# EAGLE design AnalogI_3_3V_LevelShift (EAGLE 7.6.0)
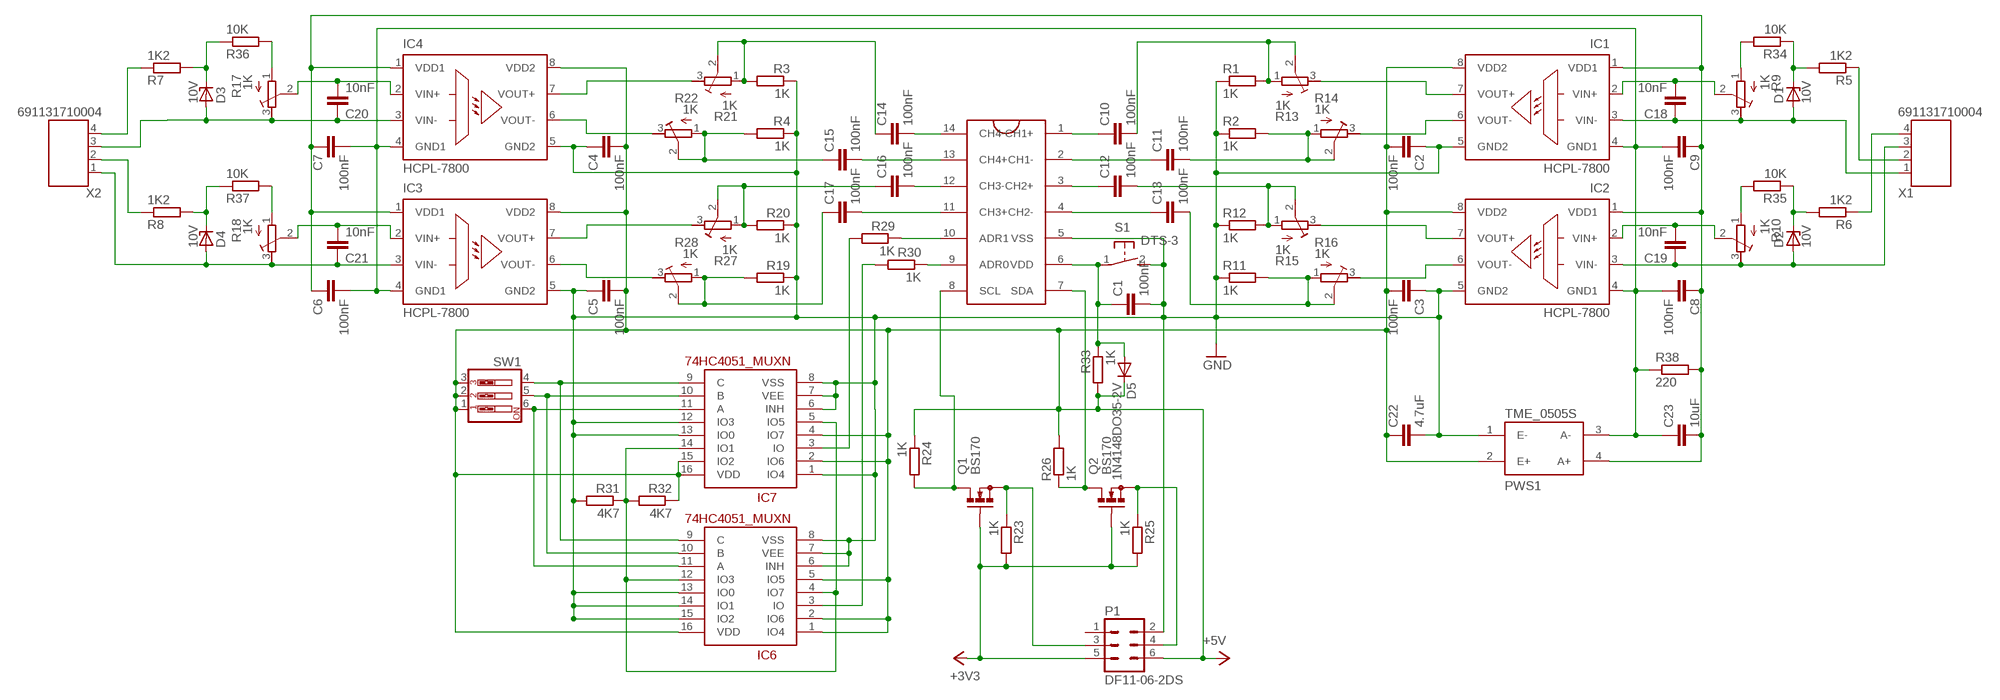
[diagram p0: schematic, sheet 1]

## Parts
C1  100nF  C-EU025-024X044  [C025-024X044]
C2  100nF  C-EU025-024X044  [C025-024X044]
C3  100nF  C-EU025-024X044  [C025-024X044]
C4  100nF  C-EU025-024X044  [C025-024X044]
C5  100nF  C-EU025-024X044  [C025-024X044]
C6  100nF  C-EU025-024X044  [C025-024X044]
C7  100nF  C-EU025-024X044  [C025-024X044]
C8  100nF  C-EU025-024X044  [C025-024X044]
C9  100nF  C-EU025-024X044  [C025-024X044]
C10  100nF  C5/3  [C5B3]
C11  100nF  C5/3  [C5B3]
C12  100nF  C5/3  [C5B3]
C13  100nF  C5/3  [C5B3]
C14  100nF  C5/3  [C5B3]
C15  100nF  C5/3  [C5B3]
C16  100nF  C5/3  [C5B3]
C17  100nF  C5/3  [C5B3]
C18  10nF  C2,5-3  [C2.5-3]
C19  10nF  C2,5-3  [C2.5-3]
C20  10nF  C2,5-3  [C2.5-3]
C21  10nF  C2,5-3  [C2.5-3]
C22  4.7uF  C-EUC0805  [C0805]
C23  10uF  C-EUC0805  [C0805]
D1  10V  ZENER-DIODEZD-2.5  [ZDIO-2.5]
D2  10V  ZENER-DIODEZD-2.5  [ZDIO-2.5]
D3  10V  ZENER-DIODEZD-2.5  [ZDIO-2.5]
D4  10V  ZENER-DIODEZD-2.5  [ZDIO-2.5]
D5  1N4148DO35-2V  [DO35-2V]
IC1  HCPL-7800  [DIL08]
IC2  HCPL-7800  [DIL08]
IC3  HCPL-7800  [DIL08]
IC4  HCPL-7800  [DIL08]
IC5  MCP3424SOIC  [14LDSOIC]
IC6  74HC4051_MUXN  [DIL16]
IC7  74HC4051_MUXN  [DIL16]
P1  DF11-06-2DS  [DF11-06DP-2DS]
PWS1  TME_0505S  [TMEXXXXS]
Q1  BS170  [SOT54E]
Q2  BS170  [SOT54E]
R1  1K  R-EU_0204/2V  [0204V]
R2  1K  R-EU_0204/2V  [0204V]
R3  1K  R-EU_0204/2V  [0204V]
R4  1K  R-EU_0204/2V  [0204V]
R5  1K2  R-EU_0204/2V  [0204V]
R6  1K2  R-EU_0204/2V  [0204V]
R7  1K2  R-EU_0204/2V  [0204V]
R8  1K2  R-EU_0204/2V  [0204V]
R9  1K  R-TRIMM3296W  [RTRIM3296W]
R10  1K  R-TRIMM3296W  [RTRIM3296W]
R11  1K  R-EU_0204/2V  [0204V]
R12  1K  R-EU_0204/2V  [0204V]
R13  1K  R-TRIMM3296W  [RTRIM3296W]
R14  1K  R-TRIMM3296W  [RTRIM3296W]
R15  1K  R-TRIMM3296W  [RTRIM3296W]
R16  1K  R-TRIMM3296W  [RTRIM3296W]
R17  1K  R-TRIMM3296W  [RTRIM3296W]
R18  1K  R-TRIMM3296W  [RTRIM3296W]
R19  1K  R-EU_0204/2V  [0204V]
R20  1K  R-EU_0204/2V  [0204V]
R21  1K  R-TRIMM3296W  [RTRIM3296W]
R22  1K  R-TRIMM3296W  [RTRIM3296W]
R23  1K  R-EU_0204/2V  [0204V]
R24  1K  R-EU_0204/5  [0204/5]
R25  1K  R-EU_0204/2V  [0204V]
R26  1K  R-EU_0204/2V  [0204V]
R27  1K  R-TRIMM3296W  [RTRIM3296W]
R28  1K  R-TRIMM3296W  [RTRIM3296W]
R29  1K  R-EU_0204/5  [0204/5]
R30  1K  R-EU_0204/5  [0204/5]
R31  4K7  R-EU_0204/2V  [0204V]
R32  4K7  R-EU_0204/2V  [0204V]
R33  1K  R-EU_0204/2V  [0204V]
R34  10K  R-EU_0204/2V  [0204V]
R35  10K  R-EU_0204/2V  [0204V]
R36  10K  R-EU_0204/2V  [0204V]
R37  10K  R-EU_0204/2V  [0204V]
R38  220  R-EU_0204/2V  [0204V]
S1  DTS-3  [DTS-3]
SW1  SW_DIP-3  [EDG-03]
X1  691131710004  [691131710004]
X2  691131710004  [691131710004]

## Nets
+3V3: P1.5 Q1.G Q2.G R23.2 R25.2
+5V: C2.2 C3.2 C4.2 C5.2 C22.1 D5.C IC1.8(VDD2) IC2.8(VDD2) IC3.8(VDD2) IC4.8(VDD2) IC6.1(IO4) IC6.2(IO6) IC6.5(IO5) IC6.16(VDD) IC7.2(IO6) IC7.4(IO7) IC7.15(IO2) IC7.16(VDD) P1.6 PWS1.2(E+) R24.1 R26.2 R32.1 R33.2 SW1.1 SW1.2 SW1.3
AGND: C6.2 C7.2 C8.2 C9.2 C23.1 IC1.4(GND1) IC2.4(GND1) IC3.4(GND1) IC4.4(GND1) PWS1.3(A-) R38.1
GND: C1.2 C2.1 C3.1 C4.1 C5.1 C22.2 IC1.5(GND2) IC2.5(GND2) IC3.5(GND2) IC4.5(GND2) IC5.5(VSS) IC6.6(INH) IC6.7(VEE) IC6.8(VSS) IC6.13(IO0) IC6.14(IO1) IC6.15(IO2) IC7.1(IO4) IC7.6(INH) IC7.7(VEE) IC7.8(VSS) IC7.12(IO3) IC7.13(IO0) P1.2 PWS1.1(E-) R1.1 R2.1 R3.1 R4.1 R11.1 R12.1 R19.1 R20.1 R31.2 S1.2
N$1: C14.2 IC5.14(CH4-)
N$2: C15.2 IC5.13(CH4+)
N$3: C16.2 IC5.12(CH3-)
N$4: C17.2 IC5.11(CH3+)
N$5: C19.1 D2.A IC2.3(VIN-) R10.3(E) X1.3
N$6: R5.1 X1.2
N$7: D1.C R5.2 R34.1
N$8: C6.1 C7.1 C8.1 C9.1 C23.2 IC1.1(VDD1) IC2.1(VDD1) IC3.1(VDD1) IC4.1(VDD1) PWS1.4(A+) R38.2
N$9: IC5.10(ADR1) R29.1
N$10: IC5.9(ADR0) R30.1
N$11: C18.2 IC1.2(VIN+) R9.2(S)
N$12: C19.2 IC2.2(VIN+) R10.2(S)
N$13: C10.1 IC5.1(CH1+)
N$14: C20.2 IC4.2(VIN+) R17.2(S)
N$15: C11.1 IC5.2(CH1-)
N$16: C21.1 D4.A IC3.3(VIN-) R18.3(E) X2.1
N$17: C12.1 IC5.3(CH2+)
N$18: C12.2 R12.2 R15.1(A) R15.2(S)
N$19: C21.2 IC3.2(VIN+) R18.2(S)
N$20: R6.1 X1.4
N$21: D2.C R6.2 R35.1
N$22: IC1.7(VOUT+) R13.3(E)
N$23: IC1.6(VOUT-) R14.3(E)
N$24: C10.2 R1.2 R13.1(A) R13.2(S)
N$25: IC2.6(VOUT-) R16.3(E)
N$26: IC2.7(VOUT+) R15.3(E)
N$27: C11.2 R2.2 R14.1(A) R14.2(S)
N$28: R7.1 X2.4
N$29: C13.2 R11.2 R16.1(A) R16.2(S)
N$30: C18.1 D1.A IC1.3(VIN-) R9.3(E) X1.1
N$31: C13.1 IC5.4(CH2-)
N$32: D3.C R7.2 R36.1
N$34: R8.1 X2.2
N$35: D4.C R8.2 R37.1
N$36: IC7.3(IO) R29.2
N$37: IC6.9(C) IC7.9(C) SW1.4
N$38: IC4.7(VOUT+) R21.3(E)
N$39: IC4.6(VOUT-) R22.3(E)
N$40: C15.1 R4.2 R22.1(A) R22.2(S)
N$41: C20.1 D3.A IC4.3(VIN-) R17.3(E) X2.3
N$42: C14.1 R3.2 R21.1(A) R21.2(S)
N$43: IC3.6(VOUT-) R28.3(E)
N$44: IC3.7(VOUT+) R27.3(E)
N$45: C17.1 R19.2 R28.1(A) R28.2(S)
N$46: C16.1 R20.2 R27.1(A) R27.2(S)
N$47: IC6.10(B) IC7.10(B) SW1.5
N$48: IC6.11(A) IC7.11(A) SW1.6
N$49: IC6.3(IO) R30.2
N$51: IC6.4(IO7) IC6.12(IO3) IC7.5(IO5) IC7.14(IO1) R31.1 R32.2
N$52: C1.1 D5.A IC5.6(VDD) R33.1 S1.1
N$53: R9.1(A) R34.2
N$54: R10.1(A) R35.2
N$55: R17.1(A) R36.2
N$56: R18.1(A) R37.2
N$58: IC5.8(SCL) Q1.D R24.2
N$61: IC5.7(SDA) Q2.D R26.1
N$69: P1.4 Q2.S R25.1
N$71: P1.3 Q1.S R23.1
Unconnected: P1.1

## Library data of the parts
C1-C9 C22 C23 = rcl:C-EU: CAPACITOR, European symbol
C10-C21 = capacitor-wima:C: CAPACITOR naming: grid - package width
D1-D4 = diode:ZENER-DIODE: Z-Diode
D5 = diode:1N4148: DIODE high speed (Philips)
IC1-IC4 = avago:HCPL-7800: Isolation Amplifer Source: http://www.avagotech.com/docs/AV02-0410EN; MPN: HCPL-7800A#500; OC_FARNELL: 459446; OC_NEWARK: 05M6395
IC5 = mcp3424:MCP3424
IC6 IC7 = SparkFun-AnalogIC:74HC4051_MUX: 8:1 analog mux
P1 = con-hirose-df11:DF11-06-2: HEADER; OC_FARNELL: unknown
PWS1 = traco-electronic:TME_*S: DC/DC Konverter 1 Watt Source: http://www.tracopower.com/datasheet_g/tme-d.pdf; MPN: TME 0505S; OC_FARNELL: 1007538; OC_NEWARK: 51R5321
Q1 Q2 = transistor-small-signal:BS170: N-CHANNEL MOS FET; MF: ON SEMICONDUCTOR; MPN: BS170G; OC_FARNELL: 9556192
R1-R8 R11 R12 R19 R20 R29-R38 = rcl:R-EU_: RESISTOR, European symbol
R9 R10 R13-R18 R21 R22 R27 R28 = resistor:R-TRIMM: Trimm resistor
R23-R26 = rcl:R-EU_: RESISTOR, European symbol; OC_FARNELL: unknown
S1 = switch-tact:DTS-3
SW1 = special:SW_DIP-3: DIP SWITCH
X1 X2 = con-wuerth:691131710004: WR-TBL Terminal block - CUU5/4 - 4 Pins;=>Code : Con_TBL_Screw_PClamp_5.00_6911317100xx_691131710004 <http://katalog.we-online.de/media/images/eican/Con_TBL_Screw_PClamp_5.00_6911317100xx_pf2.jpg> Details see: http://katalog.we-online.de/em/datasheet/6911317100xx.pdf Created 11/3/2014, Karrer Zheng 2014 (C) Wurth Elektronik

## Board
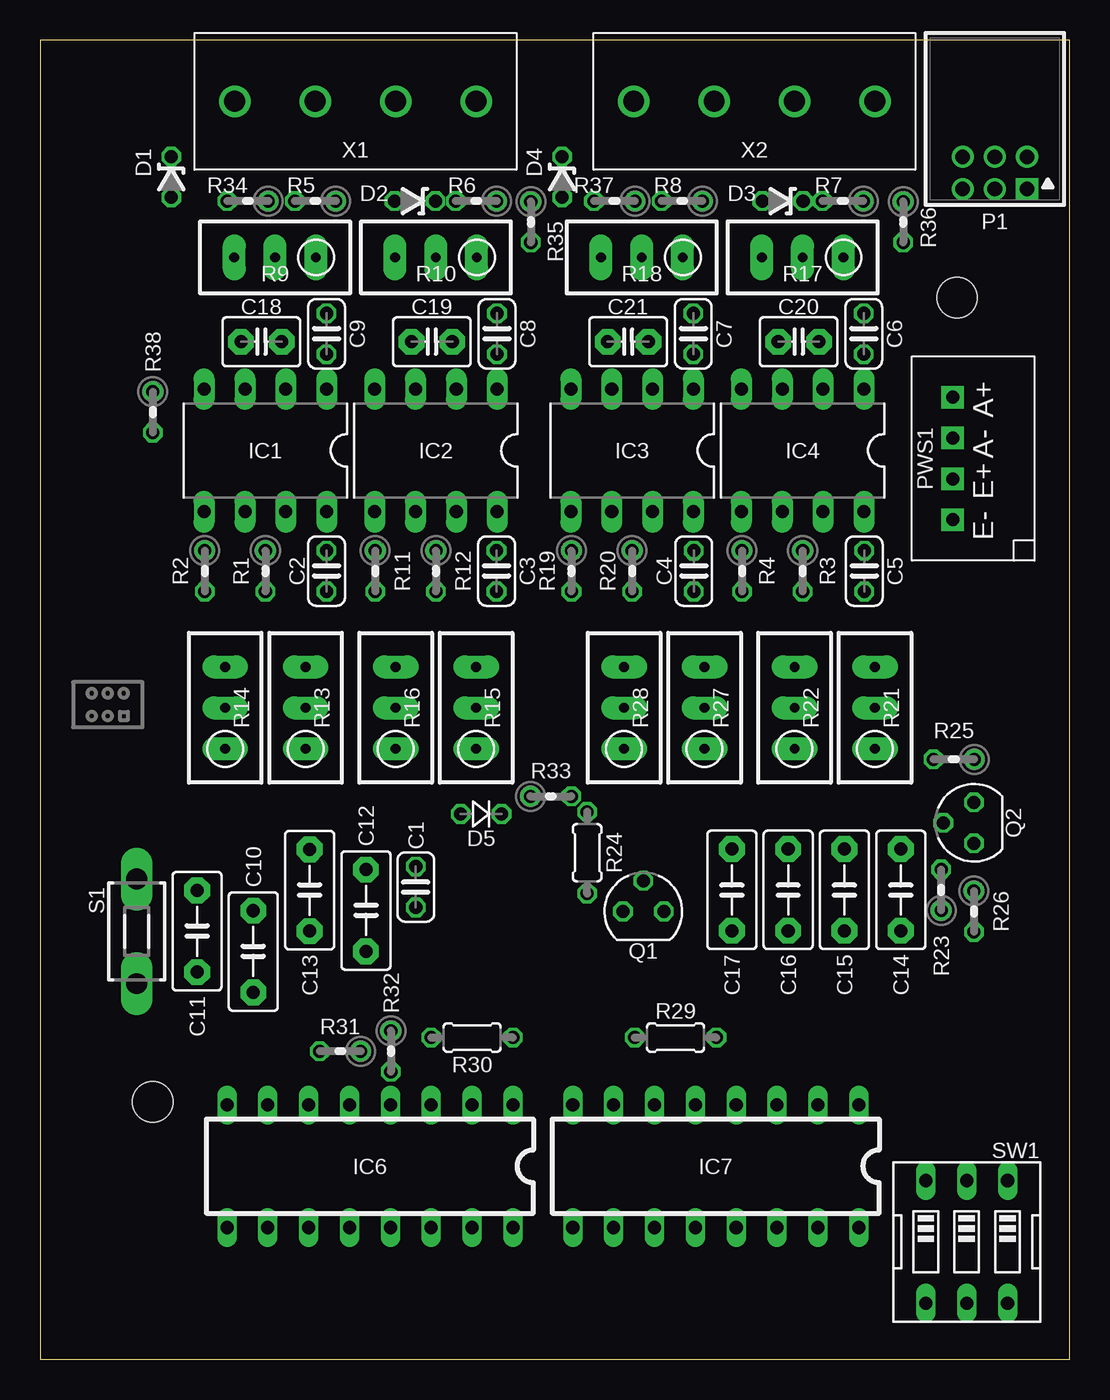
[diagram p1: board, top side]
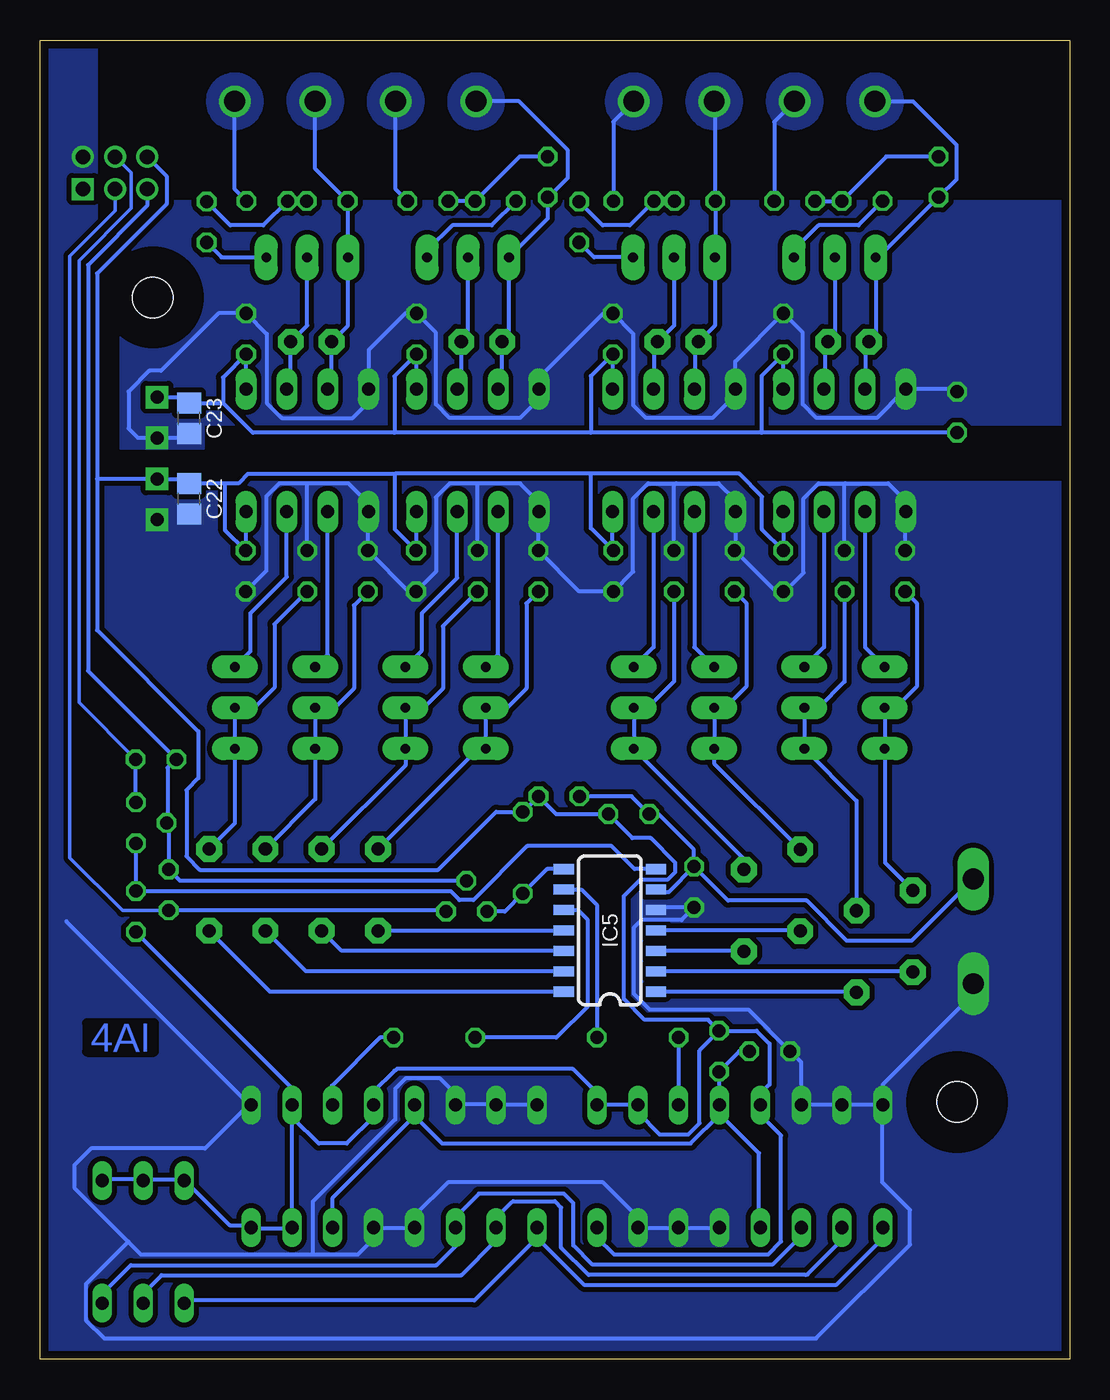
[diagram p2: board, bottom side, seen from below]

Size 64 x 82 mm. Coordinates in mm from the lower left corner, seen from the top.
Outline: 0,0 64,0 64,82 0,82 0,0
Copper layers (1*16): Top 0.035mm / dielectric 1.6mm / Bottom 0.035mm
Design rules "Elecrow": minimum track width 6mil, minimum drill 12mil, track to track 6mil, track to pad 6mil, pad to pad 6mil, via to via 8mil, smd to smd 0mil, copper to edge 20mil, drill to drill 10mil, minimum pad ring 6mil, minimum via ring 6mil, stop-mask expansion 0mil, vias tented up to drill 100mil, thermal gap 10mil
Holes 2.5 mm at 7,16 57,66
bRestrict: area 54.1,63.1 to 59.9,68.8; area 4.2,13.2 to 9.8,18.9

### Footprints (pad centres in the part's own frame; a part is rotated, then mirrored left to right if it is on the bottom)
C025-024X044 = drill 0.813 octagon: 1 -1.27,0; 2 1.27,0
C5B3 = drill 0.813 pad 1.6 octagon: 1 -2.54,0; 2 2.54,0
C2.5-3 = drill 0.813 pad 1.6 octagon: 1 -1.27,0; 2 1.27,0
C0805 = smd 1.3 x 1.5: 1 -0.95,0; 2 0.95,0
ZDIO-2.5 = drill 0.813 octagon: A 1.27,0; C -1.27,0
DO35-2V = drill 0.813 octagon: A 1.27,0; C -1.27,0
DIL08 = drill 0.813 pad 1.3 long: 1 -3.81,-3.81; 2 -1.27,-3.81; 3 1.27,-3.81; 4 3.81,-3.81; 5 3.81,3.81; 6 1.27,3.81; 7 -1.27,3.81; 8 -3.81,3.81
14LDSOIC = smd 1.27 x 0.635: 1 -2.87,3.81; 2 -2.87,2.54; 3 -2.87,1.27; 4 -2.87,0; 5 -2.87,-1.27; 6 -2.87,-2.54; 7 -2.87,-3.81; 8 2.87,-3.81; 9 2.87,-2.54; 10 2.87,-1.27; 11 2.87,0; 12 2.87,1.27; 13 2.87,2.54; 14 2.87,3.81
DIL16 = drill 0.813 long: 1 -8.89,-3.81; 2 -6.35,-3.81; 3 -3.81,-3.81; 4 -1.27,-3.81; 5 1.27,-3.81; 6 3.81,-3.81; 7 6.35,-3.81; 8 8.89,-3.81; 9 8.89,3.81; 10 6.35,3.81; 11 3.81,3.81; 12 1.27,3.81; 13 -1.27,3.81; 14 -3.81,3.81; 15 -6.35,3.81; 16 -8.89,3.81
DF11-06DP-2DS = drill 0.914 square: 1 2,-1 | drill 0.914: 2 2,1; 3 0,-1; 4 0,1; 5 -2,-1; 6 -2,1
TMEXXXXS = drill 0.813 pad 1.397 square: 1 -3.81,1.27; 2 -1.27,1.27; 3 1.27,1.27; 4 3.81,1.27
SOT54E = drill 0.813 octagon: D -1.27,0; G 0,1.905; S 1.27,0
0204V = drill 0.813 octagon: 1 -1.27,0; 2 1.27,0
RTRIM3296W = drill 0.61 pad 1.422 long: 1 0,-2.54; 2 0,0; 3 0,2.54
0204/5 = drill 0.813 octagon: 1 -2.54,0; 2 2.54,0
DTS-3 = drill 1.3 long: 1 -3.25,0; 2 3.25,0
EDG-03 = drill 0.813 long: 1 -2.54,-3.81; 2 0,-3.81; 3 2.54,-3.81; 4 2.54,3.81; 5 0,3.81; 6 -2.54,3.81
691131710004 = drill 1.3: 1 -7.5,0; 2 -2.5,0; 3 2.5,0; 4 7.5,0

### Placement (x,y rotation side)
C1  23.35,29.36 270 top
C2  17.8,49 90 top
C3  28.37,49 90 top
C4  40.63,49 90 top
C5  51.23,49 90 top
C6  51.2,63.75 90 top
C7  40.6,63.75 90 top
C8  28.4,63.75 90 top
C9  17.8,63.75 90 top
C10  13.25,25.35 90 top
C11  9.75,26.61 90 top
C12  20.25,27.9 90 top
C13  16.75,29.16 90 top
C14  53.5,29.18 270 top
C15  50,29.18 270 top
C16  46.5,29.18 270 top
C17  43,29.18 270 top
C18  13.75,63.25 0 top
C19  24.35,63.25 0 top
C20  47.15,63.25 0 top
C21  36.55,63.25 0 top
C22  54.75,53.5 270 bottom
C23  54.75,58.5 90 bottom
D1  8.15,73.5 270 top
D2  23.3,72 180 top
D3  46.16,72 180 top
D4  32.45,73.5 270 top
D5  27.41,33.9 180 top
IC1  14,56.5 180 top
IC2  24.6,56.5 180 top
IC3  36.8,56.5 180 top
IC4  47.4,56.5 180 top
IC5  28.59,26.66 180 bottom
IC6  20.5,12 180 top
IC7  42,12 180 top
P1  59.35,73.75 0 top
PWS1  58,56 90 top
Q1  37.5,27.84 0 top
Q2  58.05,33.35 90 top
R1  14,49 270 top
R2  10.23,49 270 top
R3  47.4,49 270 top
R4  43.63,49 270 top
R5  17.1,72 180 top
R6  27.1,72 180 top
R7  49.9,72 180 top
R8  39.9,72 180 top
R9  14.6,68.5 90 top
R10  24.6,68.5 90 top
R11  20.83,49 270 top
R12  24.6,49 270 top
R13  16.5,40.5 0 top
R14  11.5,40.5 0 top
R15  27.1,40.5 0 top
R16  22.1,40.5 0 top
R17  47.4,68.5 90 top
R18  37.4,68.5 90 top
R19  33.03,49 270 top
R20  36.8,49 270 top
R21  51.9,40.5 0 top
R22  46.9,40.5 0 top
R23  56.01,29.18 90 top
R24  34,31.49 270 top
R25  56.8,37.3 180 top
R26  58.05,27.84 270 top
R27  41.3,40.5 0 top
R28  36.3,40.5 0 top
R29  39.5,20 0 top
R30  26.85,20 180 top
R31  18.65,19.15 180 top
R32  21.8,19.15 270 top
R33  31.75,35 0 top
R34  12.9,72 180 top
R35  30.5,70.7 270 top
R36  53.65,70.7 270 top
R37  35.7,72 180 top
R38  7,58.88 270 top
S1  6,26.6 270 top
SW1  57.6,7.3 180 top
X1  19.6,78.2 0 top
X2  44.4,78.2 0 top

### Tracks (layer width: path | path; a pad name or v marks a point on that pad's centre or on a via)
+3V3
  Bottom 0.203: Q2.G 56.01,33.36
  Bottom 0.254: 56.03,30.45 R23.2 | Q1.G 55.3,29.75 R23.2 | R23.2 56.01,33.36 56.01,33.45 56.08,33.53 56.08,36.78 55.68,37.19 R25.2 61.03,42.8 61.03,68.02 57.35,71.7 P1.5
+5V
  Bottom 0.254: IC6.1 29.26,15.85 27.03,15.85 IC6.2 26.85,15.34 25.49,13.98 23.74,13.98 23.72,13.96 23.01,14.67 23.01,19.19 21.8,20.4 R32.1 | SW1.1 59.94,11.18 57.71,11.18 SW1.2 57.51,11.18 55.07,11.18 SW1.3 54.86,10.97 52.22,8.33 51,8.33 IC7.16 50.8,8.13 48.36,8.13 IC7.15 48.35,14.77 48.2,14.92 | R32.1 19.47,20.42 18.66,19.61 18.66,17.09 19.22,16.53 IC6.5 | 29.26,8.13 IC6.16 29.37,8.17 29.37,7.56 28.31,6.5 18.77,6.5 17.95,7.32 17.95,13.91 19.22,15.18 IC6.5 | 19.1,15.65 IC6.5 | IC7.4 43.28,15.65 43.28,15.07 44.94,13.41 46.69,13.41 48.2,14.92 | 48.16,15.65 IC7.2 | 29.46,15.85 IC6.1 | 43.28,15.85 IC7.4 | IC7.2 48.36,15.85 48.36,16.88 R26.2 | IC7.4 43.29,15.83 43.29,16.62 41.97,17.94 41.95,17.94 41.84,18.05 30.89,18.05 29.4,16.56 IC6.1 | 48.2,14.92 48.32,15.04 48.32,15.78 IC7.2 | R32.1 22.48,21.1 26.42,21.1 27.72,22.4 27.72,28.79 26.67,29.84 24.96,29.84 24.51,30.29 24.51,30.87 26.04,32.4 27.18,32.4 D5.C 31.92,33.9 R33.2 R24.1 35.66,34.03 39.26,30.43 54.08,30.43 54.91,31.26 54.91,35.39 54.17,36.13 54.17,39.03 60.47,45.33 60.47,54.74 | P1.6 56.15,73.55 56.15,71.82 60.47,67.5 60.47,54.74 | 29.76,55.05 41.95,55.05 | IC1.8 C2.2 19.12,51.59 19.12,53.63 20.54,55.05 29.76,55.05 | 29.76,55.05 29.76,51.66 C3.2 28.41,50.31 IC2.8 | 41.95,55.05 41.95,51.59 C4.2 40.63,52.67 IC3.8 | 41.95,55.05 51.07,55.05 51.67,54.45 52.49,54.45 | 52.49,54.45 C22.1 55.03,54.73 PWS1.2 60.46,54.73 60.47,54.74 | 52.49,54.45 52.49,51.53 C5.2 51.21,50.29 IC4.8
AGND
  Bottom 0.254: C8.2 | C8.2 28.99,65.02 33.01,61 33.01,60.33 | 33.01,60.33 IC3.4 | C23.1 55.03,57.27 PWS1.3 56.75,57.29 57.93,57.29 58.51,57.87 58.51,60.16 57.21,61.46 56.48,61.46 52.92,65.02 C6.2 49.92,63.74 49.92,59.45 48.99,58.52 44.57,58.52 43.59,59.5 IC4.4 43.57,60.33 43.57,62.74 41.29,65.02 C7.2 39.4,63.82 39.4,59.37 38.55,58.52 34.16,58.52 33.01,59.67 33.01,60.33 | C8.2 27.12,63.74 27.12,59.29 26.35,58.52 22.21,58.52 20.79,59.94 IC2.4 20.79,62.03 C9.2 16.59,63.81 16.59,59.37 15.74,58.52 11.99,58.52 10.36,60.15 IC1.4 7.16,60.31 R38.1
  pour Bottom (isolate 0.305, no thermals): 0,58.1 59,58.1 59,72 0,72
  pour Bottom (isolate 0.305, no thermals): 59,58.5 59,56.62 53.85,56.62 53.85,58.5
GND
  Bottom 0.203: 47.05,6.62 47.06,6.62 47.06,6.5
  Bottom 0.254: 10.23,52.69 R2.1 | IC2.5 20.79,50.31 R11.1 20.73,50.19 18.29,47.75 17.88,47.75 C2.1 17.68,47.75 16.55,48.88 16.55,53.52 15.62,54.45 13.96,54.45 | 20.93,52.83 IC2.5 | IC6.8 11.79,15.85 14.02,15.85 IC6.7 | IC7.8 33.12,15.85 35.56,15.85 IC7.7 35.76,15.85 38,15.85 IC7.6 | 24.47,54.45 26.21,54.45 27.14,53.52 27.14,48.96 C3.1 30.49,47.73 R19.1 33.03,52.65 IC3.5 32.99,53.27 34.17,54.45 36.76,54.45 | 24.47,54.45 21.83,54.45 20.82,53.44 20.82,52.72 IC2.5 | R12.1 24.6,54.32 24.47,54.45 | 13.96,54.45 11.28,54.45 10.24,53.41 10.24,52.74 | R1.1 14,54.41 13.96,54.45 | 14.13,15.83 IC6.7 | 43.29,8.83 43.29,8.74 | 43.29,8.74 43.29,8.21 | 43.27,8.7 43.26,8.71 43.28,8.74 | 21.74,8.33 IC6.13 21.98,8.19 24.21,8.19 IC6.14 24.38,8.13 26.82,8.13 IC6.15 | IC7.12 40.78,8.19 43.02,8.19 IC7.13 | 25.36,27.93 IC5.5 25.45,27.93 25.29,28.09 C1.2 | IC6.7 IC6.6 | 43.28,8.74 43.29,8.74 | 43.28,8.74 IC7.13 | IC6.6 16.69,18.46 R31.2 19.98,21.75 26.12,21.75 27.11,22.74 27.11,26.81 26.61,27.31 24.13,27.31 C1.2 | 23.16,28.25 C1.2 | 62.38,27.23 51,15.85 IC7.1 51.05,15.81 53.75,13.11 60.84,13.11 61.88,12.07 61.88,10.67 58.52,7.32 | 27.03,8.33 IC6.15 | 40.64,8.33 IC7.12 | 38.2,15.85 IC7.6 | 43.28,8.13 IC7.13 | 16.87,15.65 IC6.6 | 58.52,7.32 57.71,6.5 47.06,6.5 44.27,6.5 43.28,7.49 IC7.13 | IC7.6 38.17,15.83 38.17,16.5 39.13,17.46 41.29,17.46 41.93,16.82 41.93,14.91 47.05,9.79 47.05,6.62 47.05,6.6 | 58.52,7.32 61.16,4.67 61.16,2.44 60.02,1.29 15.76,1.29 9.93,7.12 9.93,9.28 11.66,11.01 11.66,15.54 IC6.8 | 11.58,15.65 IC6.8 | IC7.12 40.72,8.94 38.66,11 29.01,11 26.85,8.84 IC6.15 | 36.76,54.45 38.54,54.45 39.4,53.59 39.4,48.96 C4.1 41.09,47.73 R4.1 43.63,52.65 IC4.5 43.59,53.21 44.83,54.45 47.38,54.45
  Bottom 0.254: R20.1 36.8,54.41 36.76,54.45 | 47.38,54.45 49.14,54.45 49.95,53.64 49.95,49.01 C5.1 | R3.1 47.4,54.43 47.38,54.45 | S1.2 6,22.7 11.62,17.08 IC6.8
  pour Bottom (isolate 0.305, no thermals): 0,54.54 64,54.54 64,0 0,0
  pour Bottom (isolate 0.305, no thermals): 60.5,54.54 29.5,54.54 29.5,0 64,0 64,82 60.5,82
N$1
  Bottom 0.254: IC5.14 49.71,22.85 C14.2
N$2
  Bottom 0.254: IC5.13 47.48,24.12 C15.2
N$3
  Bottom 0.254: IC5.12 45.25,25.39 C16.2
N$4
  Bottom 0.254: IC5.11 31.41,26.64 C17.2
N$5
  Bottom 0.254: X1.3 22.03,78.13 D2.A 22.03,68.53 R10.3 22.06,64.27 C19.1 23.28,63.05 23.28,61.05 23.33,61 IC2.3
  pour Bottom (no thermals): 21,77 arc180 23.2,79.4 arc180
N$6
  Bottom 0.254: X1.2 18.37,76.93 R5.1
  pour Bottom (no thermals): 16,77 arc180 18.2,79.4 arc180
N$7
  Bottom 0.254: R5.2 R34.1 11.4,74.77 D1.C
N$8
  Bottom 0.254: IC4.1 C6.1 52.64,61.04 52.64,59.45 | IC3.1 C7.1 41.97,61.11 41.97,57.6 | IC2.1 C8.1 29.76,61.12 29.76,57.6 | IC1.1 C9.1 19.15,61.13 19.15,57.6 | 19.15,57.6 29.76,57.6 | 29.76,57.6 41.97,57.6 | 41.97,57.6 50.79,57.6 52.64,59.45 | PWS1.4 55.11,59.81 C23.2 52.64,59.45 | R38.2 19.15,57.6
N$9
  Bottom 0.254: IC5.10 30.57,27.93 29.99,27.35 29.99,21.92 31.91,20 R29.1
N$10
  Bottom 0.254: IC5.9 30.35,29.2 29.4,28.25 R30.1
N$11
  Bottom 0.254: IC1.2 15.27,60.79 15.22,60.84 15.22,63.05 C18.2 14.6,63.67 R9.2
N$12
  Bottom 0.254: IC2.2 25.87,61.03 25.83,61.07 25.83,63.04 C19.2 24.6,64.27 R10.2
N$13
  Bottom 0.254: 25.74,22.8 IC5.1 13.29,22.85 C10.1
N$14
  Bottom 0.254: IC4.2 48.42,60.56 C20.2 47.4,64.27 R17.2
N$15
  Bottom 0.254: 25.75,24.08 IC5.2 9.8,24.12 C11.1
N$16
  Bottom 0.254: IC3.3 35.28,60.56 C21.1 34.86,63.67 R18.3 32.45,70.91 D4.A 32.4,72.23 31.19,73.44 31.19,75.16 34.23,78.2 X2.1
  pour Bottom (no thermals): 35.8,77 arc180 38,79.4 arc180
N$17
  Bottom 0.254: 25.77,25.37 IC5.3 20.28,25.39 C12.1
N$18
  Bottom 0.254: 27.1,37.94 27.1,40.38 R15.2 26.24,40.5 24.6,42.14 R12.2 | 27.1,37.94 R15.1 | 27.1,37.94 20.25,31.09 C12.2
N$19
  Bottom 0.254: R18.2 37.4,63.67 C21.2 37.82,60.56 IC3.2
N$20
  Bottom 0.254: X1.4 28.37,76.93 R6.1
  pour Bottom (no thermals): 26,77 arc180 28.2,79.4 arc180
N$21
  Bottom 0.254: D2.C R6.2 27.34,70.5 29.03,70.5 R35.1
N$22
  Bottom 0.254: IC1.7 15.27,44.27 R13.3
N$23
  Bottom 0.254: IC1.6 12.73,44.27 R14.3
N$24
  Bottom 0.254: R1.2 14,42.13 15.63,40.5 R13.2 16.49,40.46 16.49,38.02 R13.1 13.25,34.71 C10.2
N$25
  Bottom 0.254: IC2.6 23.33,44.27 R16.3
N$26
  Bottom 0.254: IC2.7 25.87,44.27 R15.3
N$27
  Bottom 0.254: R2.2 9.51,47.01 9.51,41.82 10.83,40.5 R14.2 R14.1 11.48,37.94 11.48,30.88 C11.2
N$28
  Bottom 0.254: R7.1 51.9,72.73 X2.4
  pour Bottom (no thermals): 50.8,77 arc180 53,79.4 arc180
N$29
  Bottom 0.254: R16.1 22.09,38 22.09,40.44 R16.2 21.42,40.5 20.1,41.82 20.1,47 R11.2 | 22.12,37.94 R16.1 | R16.1 22.1,37.05 C13.2
N$30
  Bottom 0.254: X1.1 9.74,78.2 7.04,75.5 7.04,73.34 D1.A 11.88,68.5 R9.3 12.06,63.67 C18.1 12.69,63.04 12.69,60.96 12.73,60.92 IC1.3
  pour Bottom (no thermals): 11,77 arc180 13.2,79.4 arc180
N$31
  Bottom 0.254: 25.77,26.64 IC5.4 16.79,26.66 C13.1
N$32
  Bottom 0.254: D3.C R7.2 50.13,70.5 52.19,70.5 R36.1
N$34
  Bottom 0.254: R8.1 41.9,72.73 X2.2
  pour Bottom (no thermals): 40.8,77 arc180 43,79.4 arc180
N$35
  Bottom 0.254: R8.2 R37.1 34.2,74.77 D4.C
N$36
  Bottom 0.254: R29.2 42.87,20 45.86,17.01 45.86,15.86 IC7.3
N$37
  Bottom 0.254: SW1.4 54.86,3.66 37.01,3.66 33.11,7.56 | 33.12,8.13 IC7.9 33.11,7.56 | IC6.9 11.61,7.53 14.54,4.6 30.15,4.6 33.11,7.56
N$38
  Bottom 0.254: R21.3 50.92,44.02 50.92,46.38 48.67,48.63 IC4.7
N$39
  Bottom 0.254: R22.3 46.13,43.81 IC4.6
N$40
  Bottom 0.254: C15.1 46.9,34.82 R22.1 R22.2 45.7,40.5 44.5,41.7 44.5,46.86 R4.2
N$41
  Bottom 0.254: X2.3 46.9,74.01 D3.A 44.89,68.53 R17.3 44.86,64.27 C20.1 45.88,60.56 IC4.3
  pour Bottom (no thermals): 45.8,77 arc180 48,79.4 arc180
N$42
  Bottom 0.254: C14.1 51.9,33.32 R21.1 R21.2 50.69,40.5 49.43,41.76 49.43,45.7 R3.2
N$43
  Bottom 0.254: R28.3 35.53,43.81 IC3.6
N$44
  Bottom 0.254: R27.3 40.27,44.07 40.27,46.38 38.07,48.58 IC3.7
N$45
  Bottom 0.254: R28.1 R28.2 34.97,40.5 33.77,41.7 33.77,46.99 R19.2 | 36.37,38.2 R28.1 | R28.1 36.37,37.8 36.92,37.8 C17.1
N$46
  Bottom 0.254: C16.1 41.3,36.92 R27.1 R27.2 40.16,40.5 38.96,41.7 38.96,45.57 R20.2
N$47
  Bottom 0.203: 57.6,4.08 SW1.5
  Bottom 0.254: 35.56,8.33 IC7.10 | 35.76,8.13 IC7.10 | IC6.10 14.19,8.15 14.19,7.39 16.3,5.28 16.42,5.24 29.91,5.24 31.61,6.94 31.61,9.43 32,9.82 34.6,9.82 34.71,9.75 35.66,8.8 IC7.10 | IC7.10 35.66,7.39 37.82,5.23 56.45,5.23 57.6,4.08
N$48
  Bottom 0.254: 38,8.33 IC7.11 | 16.66,8.33 IC6.11 16.87,8.13 16.87,7.32 17.05,7.32 18.48,5.88 29.65,5.88 30.85,7.08 30.85,9.71 31.44,10.3 36.73,10.3 38.19,8.84 IC7.11 | 60.16,3.47 SW1.6 60.15,4.07 58.37,5.85 39.36,5.85 38.19,7.02 IC7.11
N$49
  Bottom 0.254: R30.2 IC6.3
N$51
  Bottom 0.254: R31.1 20.53,19.15 R32.2 21.8,15.84 IC6.4 | 21.54,15.44 21.74,15.65 IC6.4 | IC6.12 19.3,8.33 19.3,12.8 21.74,15.24 | 21.74,15.24 23.57,13.41 39.01,13.41 40.73,15.13 | 21.74,15.24 21.54,15.44 | 21.54,15.44 IC6.4 | 40.73,15.13 IC7.5 | IC7.14 45.81,10.05 40.73,15.13
N$52
  Bottom 0.254: IC5.6 25.45,29.2 25.28,29.03 24.94,29.03 C1.1 | 26.21,29.26 25.81,29.26 IC5.6 | IC5.6 25.81,29.06 26.21,29.06 IC5.6 | C1.1 21.23,28.51 16.35,28.51 13.85,26.01 9.84,26.01 S1.1 | C1.1 23.39,30.67 23.39,31.73 25.56,33.9 D5.A 27.24,35 R33.1
N$53
  Bottom 0.254: R9.1 17.14,68.98 15.62,70.5 13.13,70.5 R34.2
N$54
  Bottom 0.254: R10.1 29.57,68.5 R35.2
N$55
  Bottom 0.254: R36.2 52.72,68.5 R17.1
N$56
  Bottom 0.254: R37.2 35.93,70.5 38.38,70.5 39.94,68.94 R18.1
N$58
  Bottom 0.254: 31.4,30.48 IC5.8 32.48,30.47 R24.2 35.11,27.84 Q1.D
N$61
  Bottom 0.254: IC5.7 25.81,30.48 27.05,30.48 28.47,31.9 33.72,31.9 37.07,28.55 37.93,28.55 38.47,29.09 58.03,29.09 R26.1 | 58.12,29.26 R26.1 | 57.91,29.06 R26.1 | Q2.D R26.1
N$69
  Bottom 0.203: P1.4 58.35,73.75 58.35,71.55 61.59,68.31 61.59,40.82 R25.1
  Bottom 0.254: 58.12,37.19 R25.1 | Q2.S 58.05,37.28 R25.1 | 58.09,37.3 R25.1
N$71
  Bottom 0.203: 55.93,27.89 R23.1 56.03,27.89 58.88,27.89 62.16,31.17 62.16,68.58 59.35,71.39 P1.3
  Bottom 0.254: R23.1 55.99,27.89 38.82,27.89 Q1.S

### Text on the board
Bottom: 4AI
tDocu: 5.0V | SDA | GND | P1 | 3.3V | SCL | INT/NC